# Altium schematic sheet Sensor.SchDoc: Titel
size A3; ApprovedBy: name; CompanyName: DCI Electronics bv; DrawnBy: KRS; Address1: Nijverheidsstraat 14; Address2: 4458 AV Eindewege; Address3: Phone: +31 (0)113 344880; DocumentNumber: 11; Revision: 1; SheetNumber: 11; SheetTotal: 14; PageSetup: Record=PageOptions|CenterHorizontal=True|CenterVertical=True|PrintScale=1.00|XCorrection=1.00|YCorrection=1.00|PrintKind=1|BorderSize=5000000|LeftOffset=0|BottomOffset=0|Orientation=2|PaperLength=1000|PaperWidth=1000|Scale=100|PaperSource=7|PrintQuality=-4|MediaType=1|DitherType=10|PaperKind=ISO_A4_(210.00_x_297.00_MM)|PrintScaleMode=1; SubTitle: SubTitel; ApprovedDate: 01-01-12
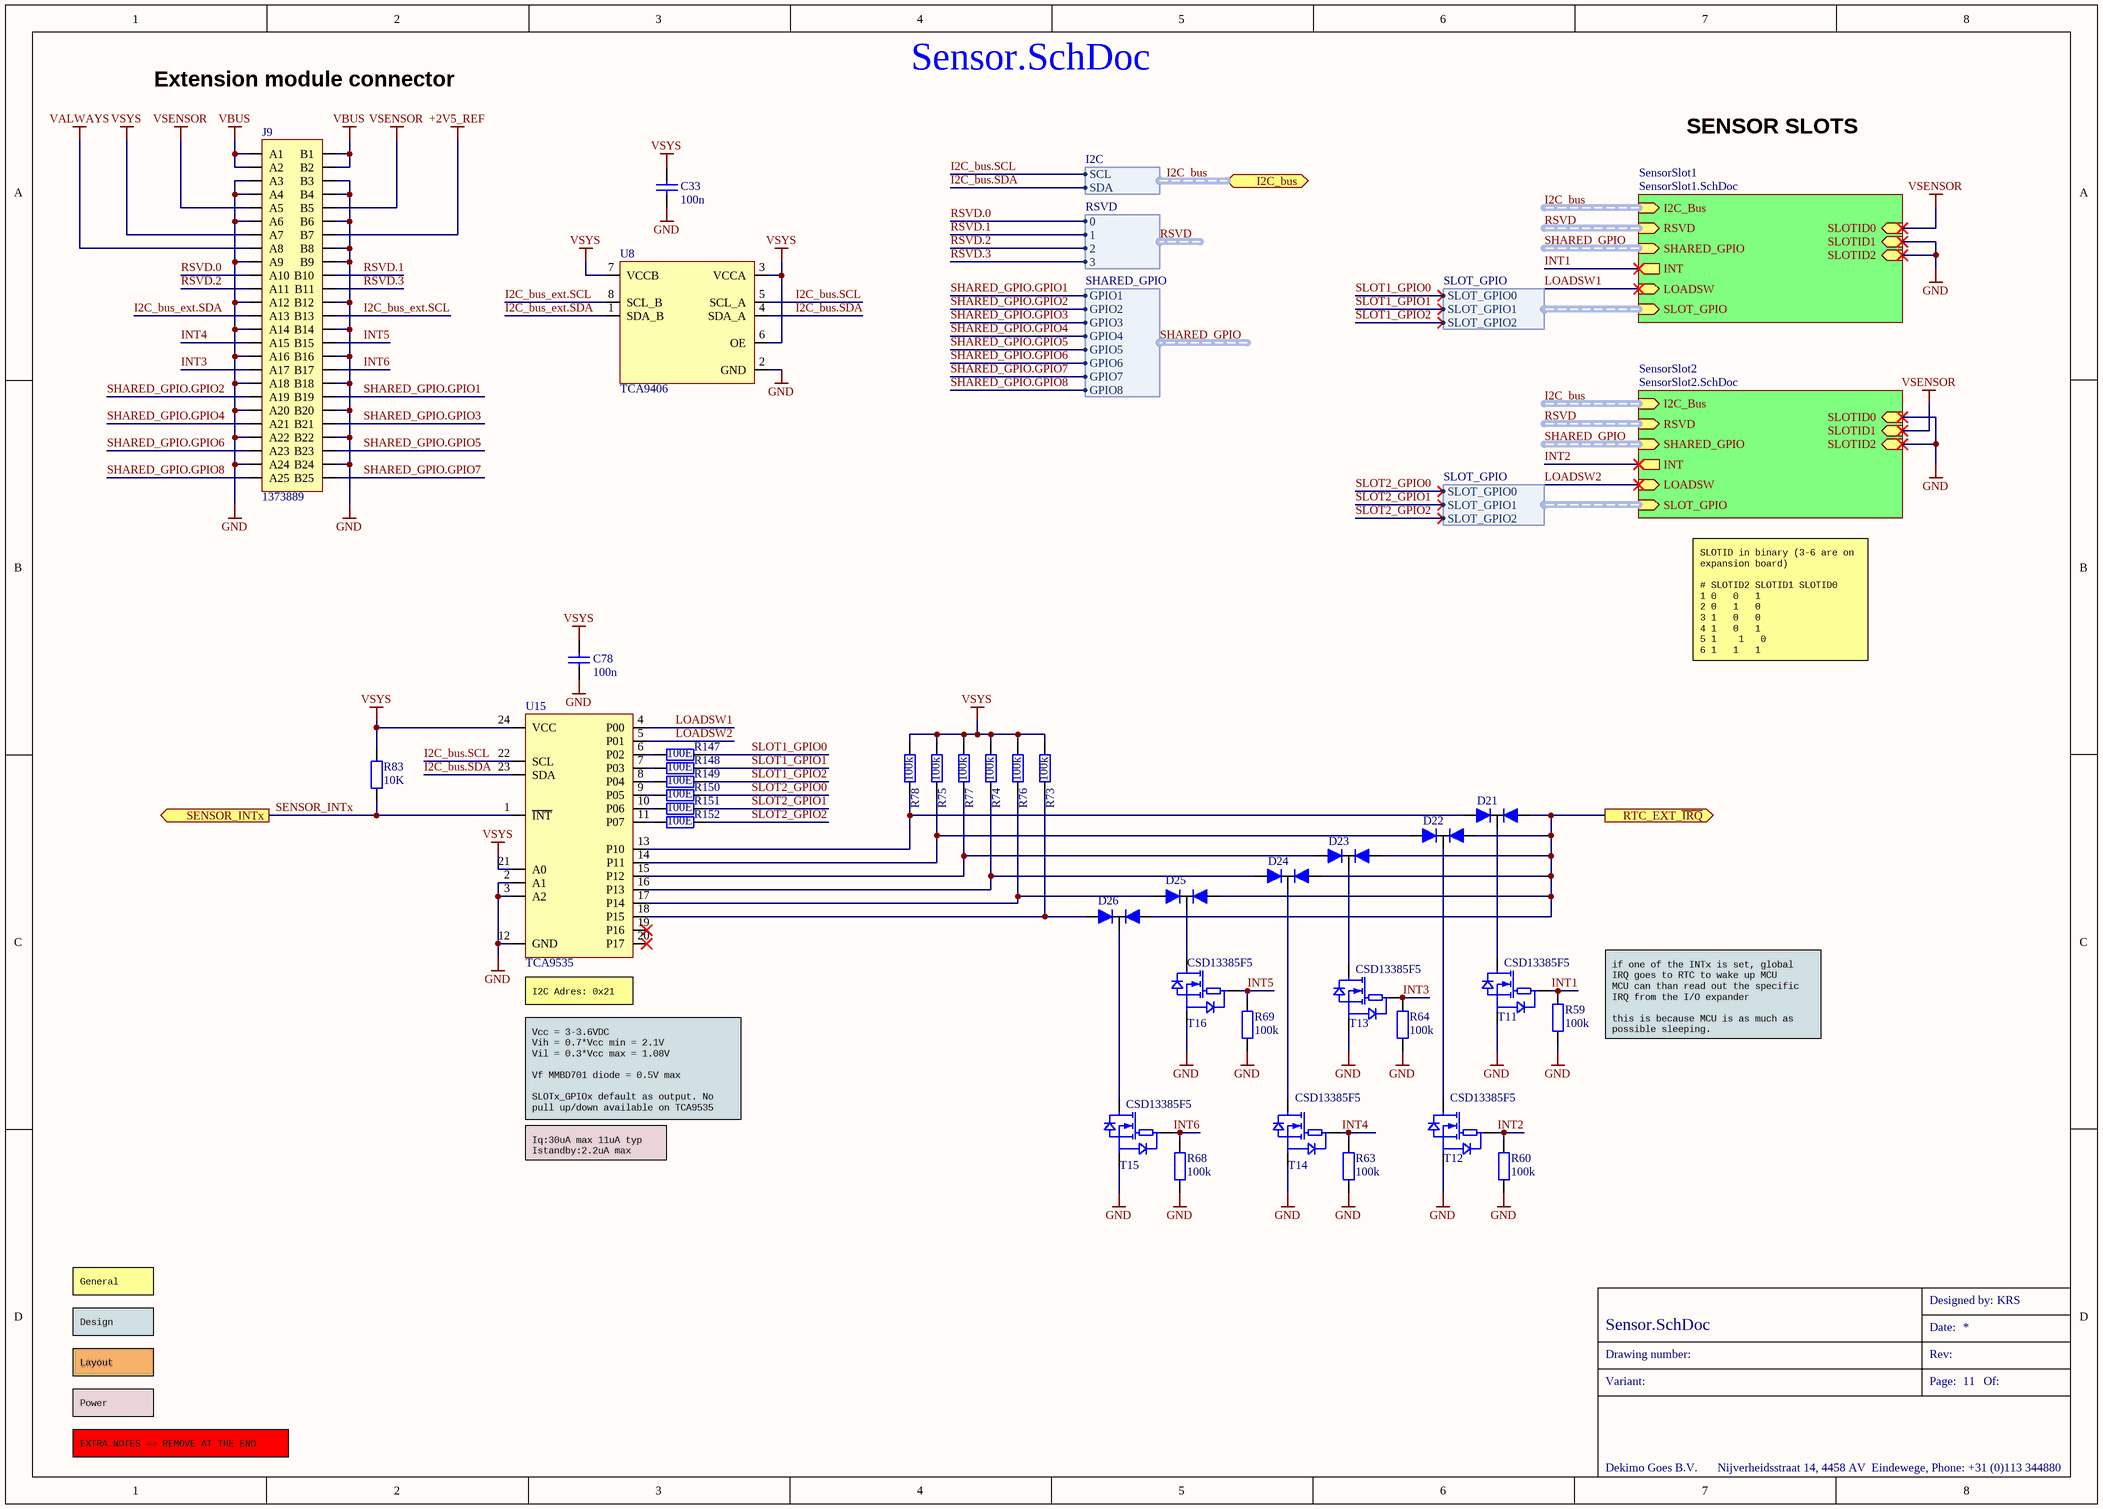
[diagram p0: Sensor.SchDoc]

## Parts
C33  100n  [CAPC1608X09N]
C78  100n  [CAPC1608X09N]
D21  DIO RB508FM-40C  [SOT-650G001-003]  (value not drawn)
D22  DIO RB508FM-40C  [SOT-650G001-003]  (value not drawn)
D23  DIO RB508FM-40C  [SOT-650G001-003]  (value not drawn)
D24  DIO RB508FM-40C  [SOT-650G001-003]  (value not drawn)
D25  DIO RB508FM-40C  [SOT-650G001-003]  (value not drawn)
D26  DIO RB508FM-40C  [SOT-650G001-003]  (value not drawn)
J9  1373889  [CON-111G003-050]
R59  100k  [RESC1005X04N]
R60  100k  [RESC1005X04N]
R63  100k  [RESC1005X04N]
R64  100k  [RESC1005X04N]
R68  100k  [RESC1005X04N]
R69  100k  [RESC1005X04N]
R73  100k  [RESC1005X04N]
R74  100k  [RESC1005X04N]
R75  100k  [RESC1005X04N]
R76  100k  [RESC1005X04N]
R77  100k  [RESC1005X04N]
R78  100k  [RESC1005X04N]
R83  10K  [RESC1608X13N]
R147  100E  [RESC1608X13N]
R148  100E  [RESC1608X13N]
R149  100E  [RESC1608X13N]
R150  100E  [RESC1608X13N]
R151  100E  [RESC1608X13N]
R152  100E  [RESC1608X13N]
T11  CSD13385F5  [DFN-500G000-003]
T12  CSD13385F5  [DFN-500G000-003]
T13  CSD13385F5  [DFN-500G000-003]
T14  CSD13385F5  [DFN-500G000-003]
T15  CSD13385F5  [DFN-500G000-003]
T16  CSD13385F5  [DFN-500G000-003]
U8  TCA9406  [SOP-650002-008]
U15  TCA9535  [SOP-650001-024]

## Sub-sheets
SensorSlot1 = SensorSlot1.SchDoc: I2C_Bus (in, harness I2C), INT (out), SLOT_GPIO (in, harness SLOT_GPIO), LOADSW (in), SLOTID0 (in), SLOTID1 (in), SLOTID2 (in), SHARED_GPIO (in, harness SHARED_GPIO), RSVD (in, harness RSVD)
SensorSlot2 = SensorSlot2.SchDoc: I2C_Bus (in, harness I2C), INT (out), LOADSW (in), SLOT_GPIO (in, harness SLOT_GPIO), SLOTID0 (in), SLOTID1 (in), SLOTID2 (in), SHARED_GPIO (in, harness SHARED_GPIO), RSVD (in, harness RSVD)

## Ports
I2C_bus (bidir, harness I2C), RTC_EXT_~{IRQ} (out), SENSOR_INTx (out)

## Harnesses
RSVD: 0, 1, 2, 3
I2C: SCL, SDA
SLOT_GPIO: SLOT_GPIO0, SLOT_GPIO1, SLOT_GPIO2
SHARED_GPIO: GPIO1, GPIO2, GPIO3, GPIO4, GPIO5, GPIO6, GPIO7, GPIO8

## Nets
+2V5_REF: J9.B7
GND: C33.1 C78.1 J9.A3 J9.A4 J9.A6 J9.A9 J9.A12 J9.A14 J9.A16 J9.A18 J9.A20 J9.A22 J9.A24 J9.B3 J9.B4 J9.B6 J9.B8 J9.B9 J9.B12 J9.B14 J9.B16 J9.B18 J9.B20 J9.B22 J9.B24 R59.1 R60.1 R63.1 R64.1 R68.1 R69.1 T11.S T12.S T13.S T14.S T15.S T16.S U8.2(GND) U15.2(A1) U15.3(A2) U15.12(GND) ; sheet SensorSlot1/SLOTID1, sheet SensorSlot1/SLOTID2, sheet SensorSlot2/SLOTID0, sheet SensorSlot2/SLOTID2
VALWAYS: J9.A8
VBUS: J9.A1 J9.A2 J9.B1 J9.B2
VSENSOR: J9.A5 J9.B5 ; sheet SensorSlot1/SLOTID0, sheet SensorSlot2/SLOTID1
VSYS: C33.2 C78.2 J9.A7 R73.2 R74.2 R75.2 R76.2 R77.2 R78.2 R83.2 U8.3(VCCA) U8.6(OE) U8.7(VCCB) U15.21(A0) U15.24(VCC)
I2C_bus.SCL: U8.5(SCL_A) U15.22(SCL) ; port I2C_bus.SCL
I2C_bus.SDA: U8.4(SDA_A) U15.23(SDA) ; port I2C_bus.SDA
I2C_bus_ext.SCL: J9.B13 U8.8(SCL_B)
I2C_bus_ext.SDA: J9.A13 U8.1(SDA_B)
INT1: R59.2 T11.G ; sheet SensorSlot1/INT
INT2: R60.2 T12.G ; sheet SensorSlot2/INT
INT3: J9.A17 R64.2 T13.G
INT4: J9.A15 R63.2 T14.G
INT5: J9.B15 R69.2 T16.G
INT6: J9.B17 R68.2 T15.G
LOADSW1: U15.4(P00) ; sheet SensorSlot1/LOADSW
LOADSW2: U15.5(P01) ; sheet SensorSlot2/LOADSW
RSVD.0: J9.A10 ; sheet SensorSlot1/RSVD.0
RSVD.1: J9.B10 ; sheet SensorSlot1/RSVD.1
RSVD.2: J9.A11 ; sheet SensorSlot1/RSVD.2
RSVD.3: J9.B11 ; sheet SensorSlot1/RSVD.3
RTC_EXT_~{IRQ}: D21.A2 D22.A2 D23.A2 D24.A2 D25.A2 D26.A2 ; port RTC_EXT_~{IRQ}
SENSOR_INTx: R83.1 U15.1(~{INT}) ; port SENSOR_INTx
SHARED_GPIO.GPIO1: J9.B19 ; sheet SensorSlot1/SHARED_GPIO.GPIO1
SHARED_GPIO.GPIO2: J9.A19 ; sheet SensorSlot1/SHARED_GPIO.GPIO2
SHARED_GPIO.GPIO3: J9.B21 ; sheet SensorSlot1/SHARED_GPIO.GPIO3
SHARED_GPIO.GPIO4: J9.A21 ; sheet SensorSlot1/SHARED_GPIO.GPIO4
SHARED_GPIO.GPIO5: J9.B23 ; sheet SensorSlot1/SHARED_GPIO.GPIO5
SHARED_GPIO.GPIO6: J9.A23 ; sheet SensorSlot1/SHARED_GPIO.GPIO6
SHARED_GPIO.GPIO7: J9.B25 ; sheet SensorSlot1/SHARED_GPIO.GPIO7
SHARED_GPIO.GPIO8: J9.A25 ; sheet SensorSlot1/SHARED_GPIO.GPIO8
SLOT1_GPIO0: R147.2 ; sheet SensorSlot1/SLOT_GPIO.SLOT_GPIO0
SLOT1_GPIO1: R148.2 ; sheet SensorSlot1/SLOT_GPIO.SLOT_GPIO1
SLOT1_GPIO2: R149.2 ; sheet SensorSlot1/SLOT_GPIO.SLOT_GPIO2
SLOT2_GPIO0: R150.2 ; sheet SensorSlot2/SLOT_GPIO.SLOT_GPIO0
SLOT2_GPIO1: R151.2 ; sheet SensorSlot2/SLOT_GPIO.SLOT_GPIO1
SLOT2_GPIO2: R152.2 ; sheet SensorSlot2/SLOT_GPIO.SLOT_GPIO2
NetD21_A1: D21.A1 R78.1 U15.13(P10)
NetD21_C: D21.C T11.D
NetD22_A1: D22.A1 R75.1 U15.14(P11)
NetD22_C: D22.C T12.D
NetD23_A1: D23.A1 R77.1 U15.15(P12)
NetD23_C: D23.C T13.D
NetD24_A1: D24.A1 R74.1 U15.16(P13)
NetD24_C: D24.C T14.D
NetD25_A1: D25.A1 R76.1 U15.17(P14)
NetD25_C: D25.C T16.D
NetD26_A1: D26.A1 R73.1 U15.18(P15)
NetD26_C: D26.C T15.D
NetR147_1: R147.1 U15.6(P02)
NetR148_1: R148.1 U15.7(P03)
NetR149_1: R149.1 U15.8(P04)
NetR150_1: R150.1 U15.9(P05)
NetR151_1: R151.1 U15.10(P06)
NetR152_1: R152.1 U15.11(P07)

Not connected (* = marked no-connect by the designer): U15 19(P16)* 20(P17)*

## Buses and harness runs
harness I2C_bus = port I2C_bus
harness I2C_bus = sheet SensorSlot1/I2C_Bus
harness I2C_bus = sheet SensorSlot2/I2C_Bus
harness RSVD = sheet SensorSlot1/RSVD
harness RSVD = sheet SensorSlot2/RSVD
harness SHARED_GPIO = sheet SensorSlot1/SHARED_GPIO
harness SHARED_GPIO = sheet SensorSlot2/SHARED_GPIO

## Notes on the sheet
- Extension module connector
- SENSOR SLOTS
- SLOTID in binary (3-6 are on expansion board)
  # SLOTID2 SLOTID1 SLOTID0
  1 0	  0	  1
  2 0	  1	  0
  3 1	  0	  0
  4 1	  0	  1
  5 1 	  1	  0
  6 1	  1	  1
- (near U15) I2C Adres: 0x21
- if one of the INTx is set, global IRQ goes to RTC to wake up MCU
  MCU can than read out the specific IRQ from the I/O expander
  this is because MCU is as much as possible sleeping.
- Vcc = 3-3.6VDC
  Vih = 0.7*Vcc min = 2.1V
  Vil = 0.3*Vcc max = 1.08V
  Vf MMBD701 diode = 0.5V max
  SLOTx_GPIOx default as output. No pull up/down available on TCA9535
- Iq:30uA max 11uA typ
  Istandby:2.2uA max
- General
- Design
- Layout
- Power
- EXTRA NOTES => REMOVE AT THE END
- Designed by:
- Drawing number:
- Variant:
- Date:
- Page:
- Rev:
- Of:
- Dekimo Goes B.V.
- Nijverheidsstraat 14, 4458 AV  Eindewege, Phone: +31 (0)113 344880

## Library data of the parts
C33 C78 = CKE 100N/60: 100nF 50V 10% X7R; EngPartGrpMainCode: CAP; ManufactpartCode: 2238 586 15649-PHI; Type: Capacitor ceramic SMD; Preferred: False; SMD_Flag: True; PartCode: CKE 100N/60
D21-D26 = DIO RB508FM-40C: RB508, 40V, 80mA 2 com cat dio; ManufactpartCode: RB508FM-40CFHT106-RO; Type: Diode SMD; Preferred: False; SMD_Flag: True; PartCode: DIO RB508FM-40C; EngPartGrpMainCode: DIO
J9 = CON BTOB50S/2: 2x25p socket 1.27mm straight; EngPartGrpMainCode: CONN; ManufactpartCode: 651-1373889-PHX; Preferred: False; SMD_Flag: True; PartCode: CON BTOB50S/2; Type: Connector Board to Board SMD
R59 R60 R63 R64 R68 R69 R73-R78 = R 100K/70: 100K, 62.5mW, 1%; EngPartGrpMainCode: RES; ManufactpartCode: RC0402FR-07100KL-YAG; Preferred: False; SMD_Flag: True; PartCode: R 100K/70; Type: Resistor metalfilm SMD
R83 = R 10K/60: 10k 100mW, 1%; EngPartGrpMainCode: RES; ManufactpartCode: RC0603FR-0710KL-YAG; Preferred: True; PartCode: R 10K/60; Type: Resistor metalfilm SMD; SMD_Flag: True
R147-R152 = R 100E/60: 100E 100mW, 1%; EngPartGrpMainCode: RES; ManufactpartCode: RC0603FR-07100RL-YAG; Preferred: True; PartCode: R 100E/60; Type: Resistor metalfilm SMD; SMD_Flag: True
T11-T16 = TRA CSD13385F5: 7.1A, 12V, N-channel FemtoFet; EngPartGrpMainCode: TRAN; ManufactpartCode: CSD13385F5-TI; Type: FET N-channel SMD; Preferred: False; SMD_Flag: True; PartCode: TRA CSD13385F5
U8 = IC TCA9406: I2C Level translator; EngPartGrpMainCode: IC; ManufactpartCode: TCA9406DCTR-TI; Preferred: False; SMD_Flag: True; PartCode: IC TCA9406; Type: IC driver SMD
U15 = IC TCA9535/SO: 16-bits  I2C I/O Expander; EngPartGrpMainCode: IC; ManufactpartCode: TCA9535PWR-TI; Preferred: False; SMD_Flag: True; PartCode: IC TCA9535/SO; Type: IC Peripheral SMD